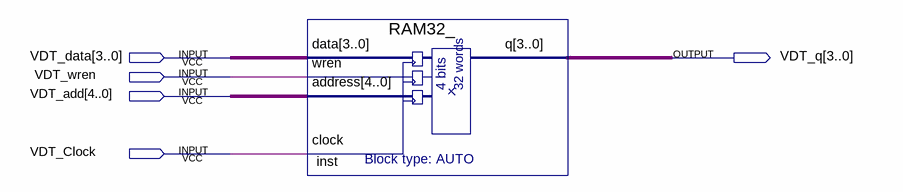
[diagram p0: schematic sheet]
// Quartus schematic assignment9.bdf as structural Verilog: 1 symbols, 5 pins
module assignment9 (
  input  [3:0] VDT_data,
  input  VDT_wren,
  input  [4:0] VDT_add,
  input  VDT_Clock,
  output [3:0] VDT_q
);

  RAM32_ inst (.data(VDT_data), .wren(VDT_wren), .address(VDT_add), .clock(VDT_Clock), .q(VDT_q));
endmodule
